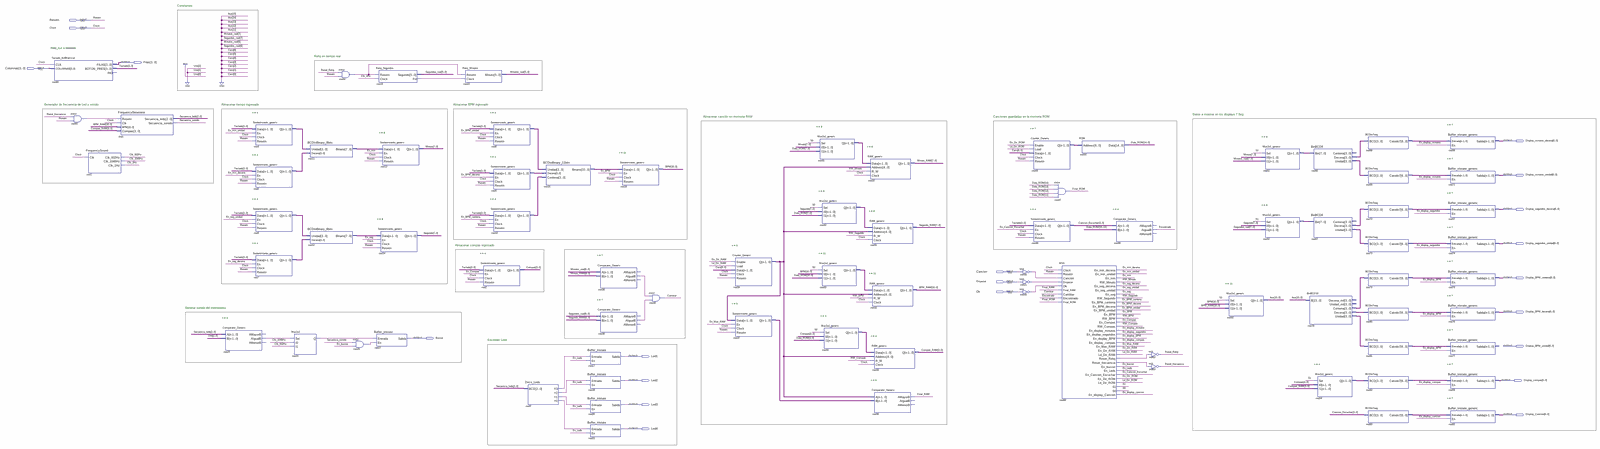
[diagram p0: schematic sheet, whole]
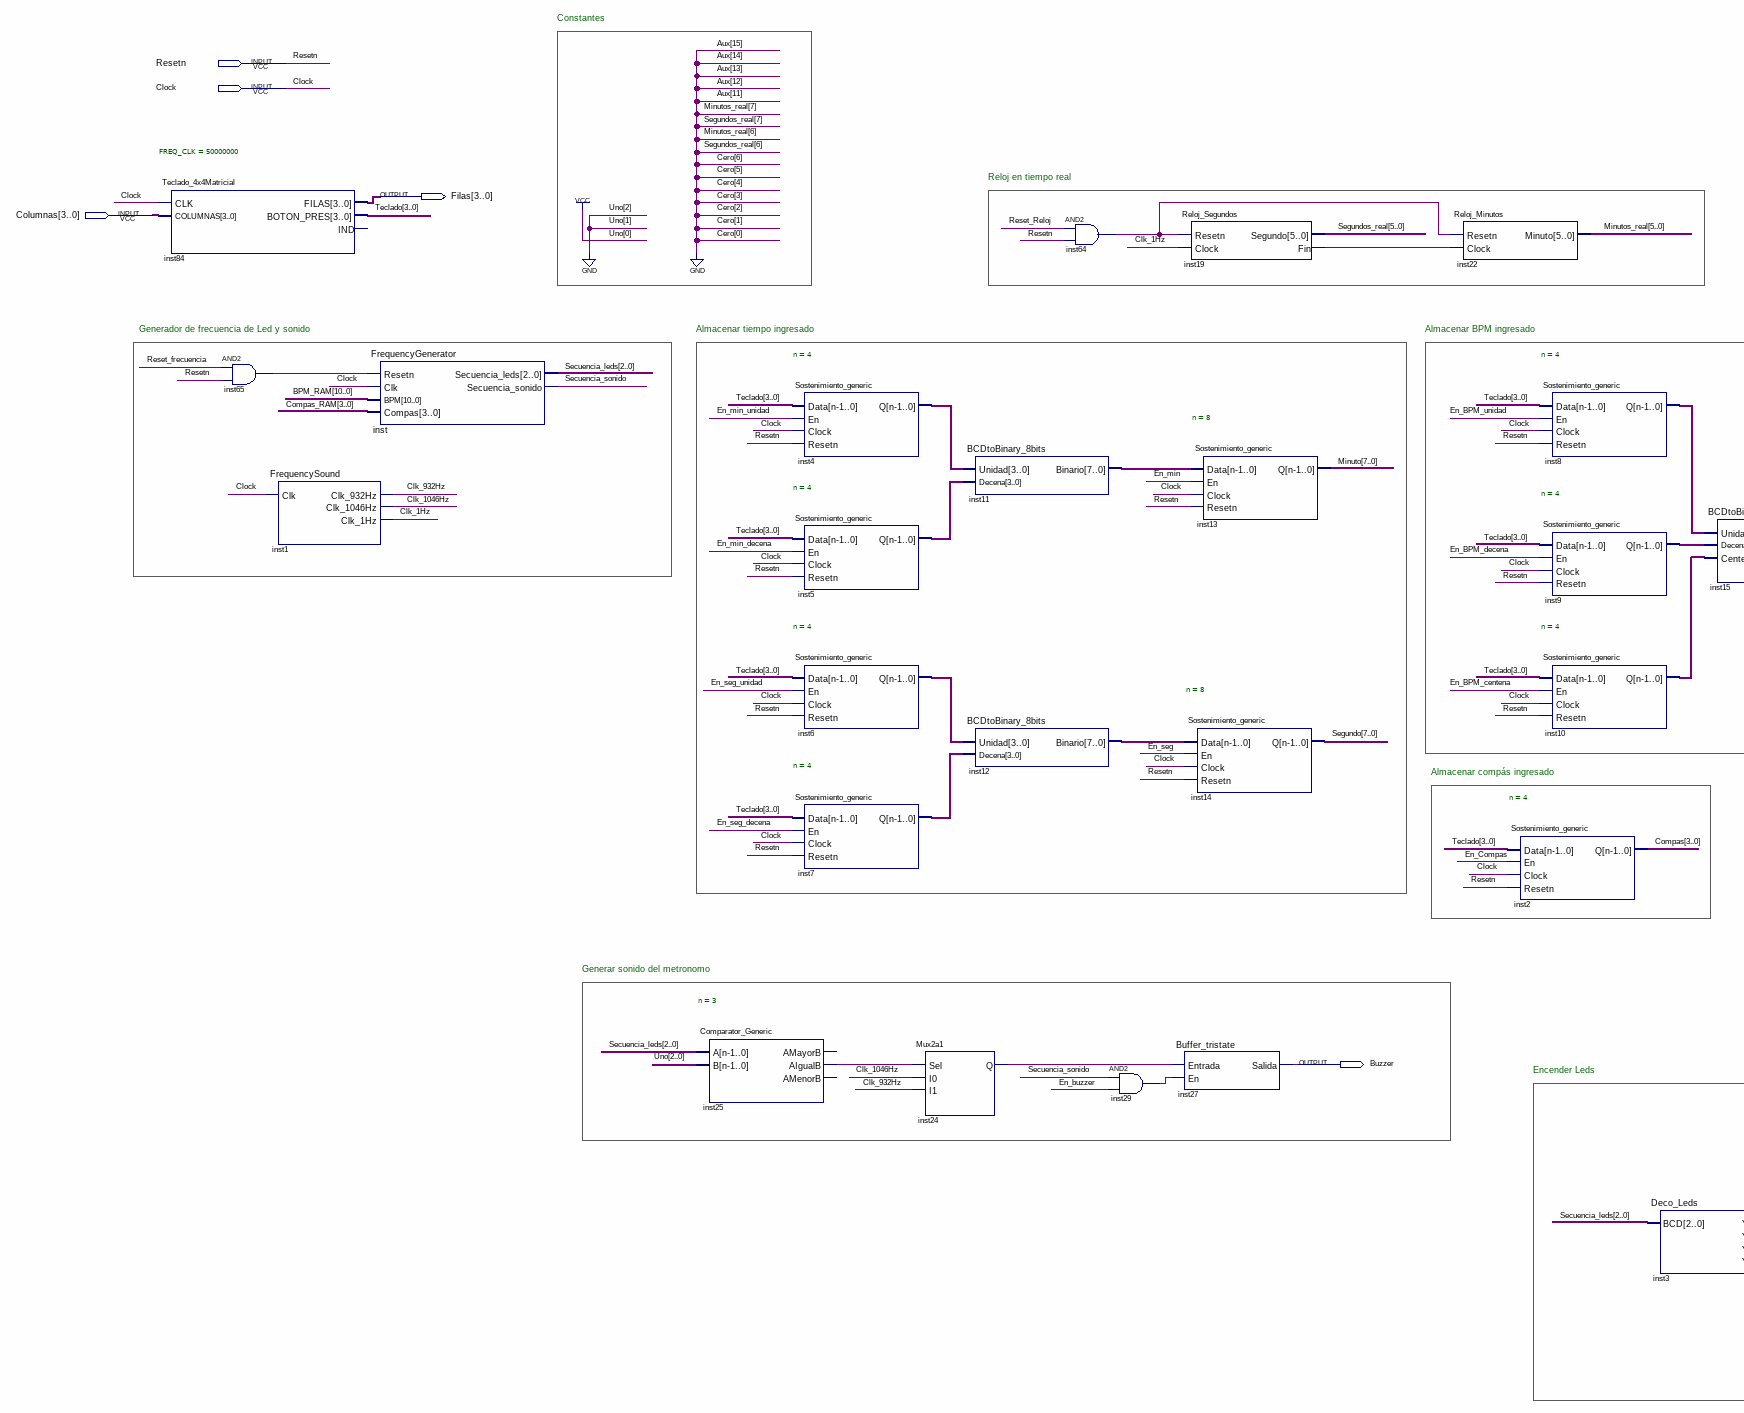
[diagram p1: schematic sheet, left part]
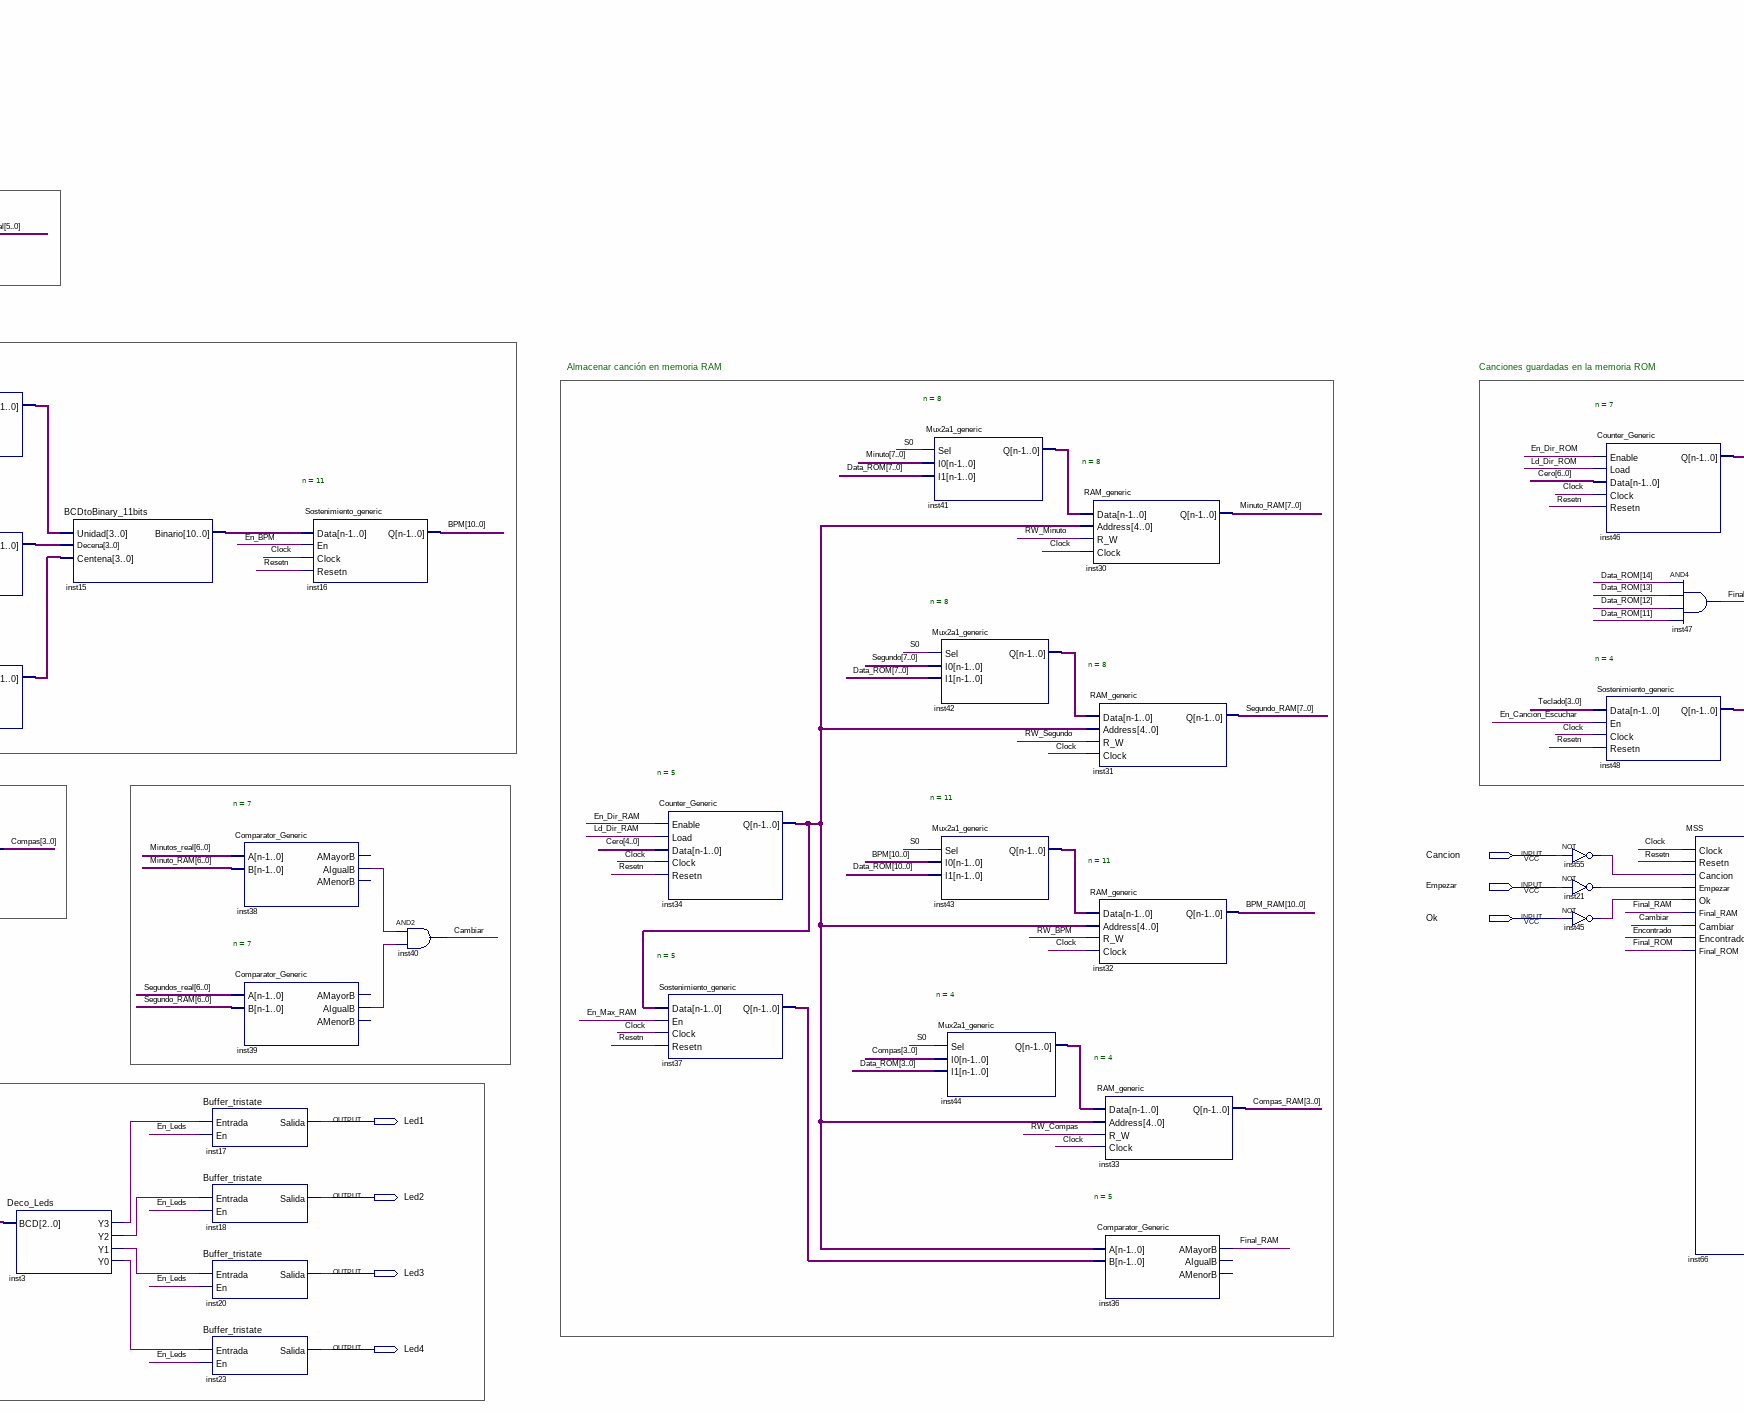
[diagram p2: schematic sheet, centre part]
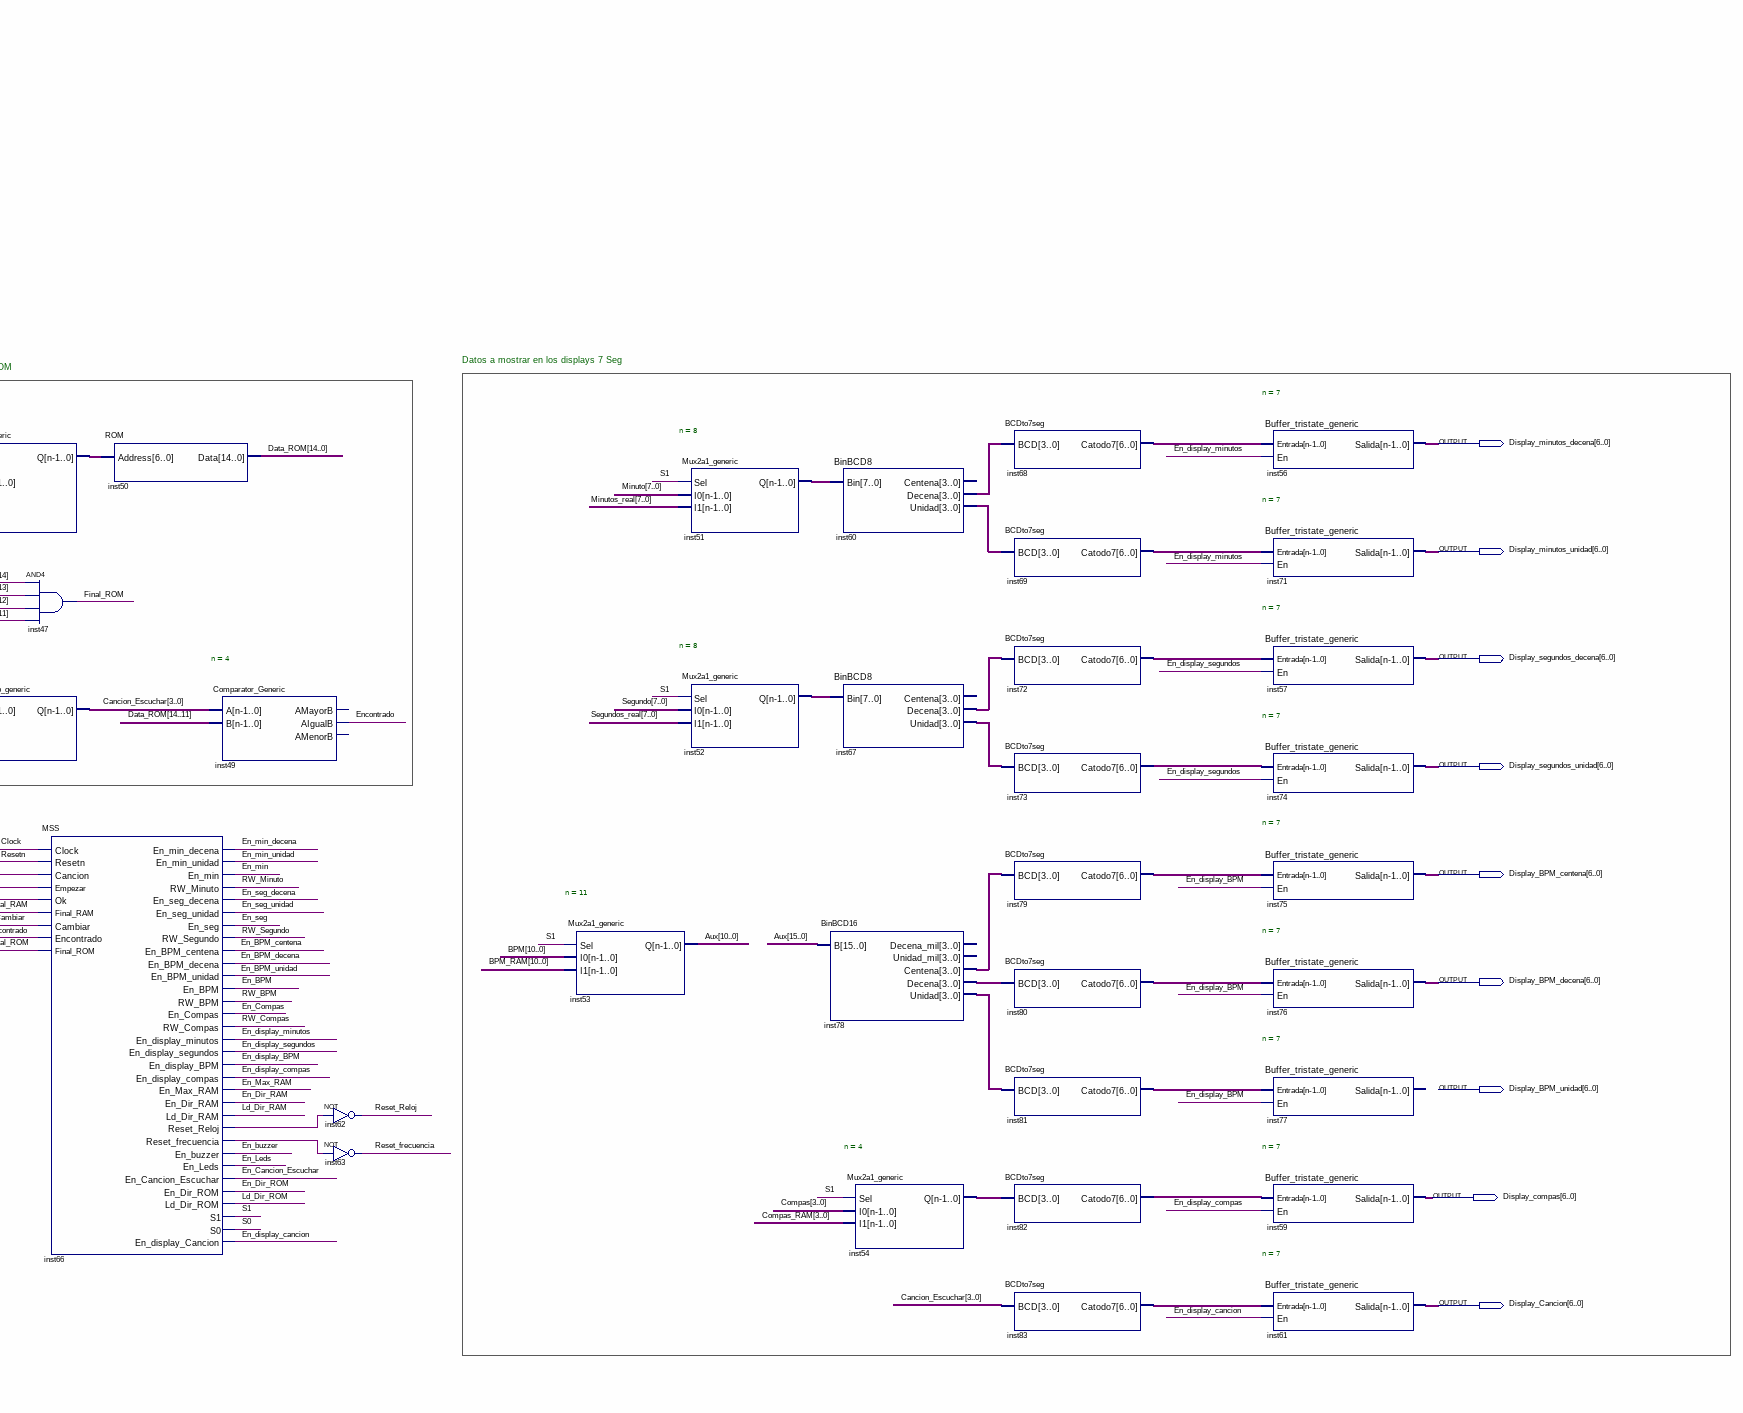
[diagram p3: schematic sheet, right part]
// Quartus schematic Diagram.bdf as structural Verilog: 80 symbols, 21 pins
module Diagram (
  input  Resetn,
  input  Clock,
  input  [3:0] Columnas,
  input  Cancion,
  input  Empezar,
  input  Ok,
  output [3:0] Filas,
  output [6:0] Display_minutos_decena,
  output [6:0] Display_minutos_unidad,
  output [6:0] Display_segundos_decena,
  output [6:0] Display_segundos_unidad,
  output [6:0] Display_BPM_centena,
  output [6:0] Display_BPM_decena,
  output Buzzer,
  output [6:0] Display_BPM_unidad,
  output Led1,
  output Led2,
  output [6:0] Display_compas,
  output Led3,
  output [6:0] Display_Cancion,
  output Led4
);

  wire Cambiar, Clk_1Hz, Clk_932Hz, Clk_1046Hz, En_BPM, En_BPM_centena, En_BPM_decena, En_BPM_unidad,
       En_buzzer, En_Cancion_Escuchar, En_Compas, En_Dir_RAM, En_Dir_ROM, En_display_BPM, En_display_cancion,
       En_display_compas, En_display_minutos, En_display_segundos, En_Leds, En_Max_RAM, En_min,
       En_min_decena, En_min_unidad, En_seg, En_seg_decena, En_seg_unidad, Encontrado, Final_RAM, Final_ROM,
       inst3_y0, inst3_y1, inst3_y2, inst3_y3, inst19_fin, inst21_out, inst24_q, inst25_aigualb, inst29_out,
       inst38_aigualb, inst39_aigualb, inst45_out, inst55_out, inst64_out, inst65_out,
       inst66_reset_frecuencia, inst66_reset_reloj, Ld_Dir_RAM, Ld_Dir_ROM, Reset_frecuencia, Reset_Reloj,
       RW_BPM, RW_Compas, RW_Minuto, RW_Segundo, S0, S1, Secuencia_sonido;
  wire [2:0] Secuencia_leds;
  wire [3:0] Cancion_Escuchar, Compas, Compas_RAM, inst4_q, inst5_q, inst6_q, inst7_q, inst8_q, inst9_q,
       inst10_q, inst44_q, inst54_q, inst60_decena, inst60_unidad, inst67_decena, inst67_unidad,
       inst78_centena, inst78_decena, inst78_unidad, Teclado;
  wire [4:0] inst34_q, inst37_q;
  wire [5:0] Minutos_real, Segundos_real;
  wire [6:0] inst46_q, inst68_catodo7, inst69_catodo7, inst72_catodo7, inst73_catodo7, inst79_catodo7,
       inst80_catodo7, inst81_catodo7, inst82_catodo7, inst83_catodo7;
  wire [7:0] inst11_binario, inst12_binario, inst41_q, inst42_q, inst51_q, inst52_q, Minuto, Minuto_RAM,
       Segundo, Segundo_RAM;
  wire [10:0] Aux, BPM, BPM_RAM, inst15_binario, inst43_q;
  wire [14:0] Data_ROM;

  Teclado_4x4Matricial #(.FREQ_CLK(50000000)) inst84 (
    .CLK(Clock), .COLUMNAS(Columnas), .FILAS(Filas), .BOTON_PRES(Teclado));  // open: IND
  and inst65 (inst65_out, Reset_frecuencia, Resetn);
  FrequencySound inst1 (.Clk(Clock), .Clk_932Hz(Clk_932Hz), .Clk_1046Hz(Clk_1046Hz), .Clk_1Hz(Clk_1Hz));
  FrequencyGenerator inst (
    .Resetn(inst65_out), .Clk(Clock), .BPM(BPM_RAM), .Compas(Compas_RAM), .Secuencia_leds(Secuencia_leds),
    .Secuencia_sonido(Secuencia_sonido));
  Comparator_Generic #(.n(3)) inst25 (
    .A(Secuencia_leds), .B(3'b001), .AIgualB(inst25_aigualb));  // open: AMayorB, AMenorB
  Sostenimiento_generic #(.n(4)) inst4 (
    .Data(Teclado), .En(En_min_unidad), .Clock(Clock), .Resetn(Resetn), .Q(inst4_q));
  Sostenimiento_generic #(.n(4)) inst5 (
    .Data(Teclado), .En(En_min_decena), .Clock(Clock), .Resetn(Resetn), .Q(inst5_q));
  Sostenimiento_generic #(.n(4)) inst6 (
    .Data(Teclado), .En(En_seg_unidad), .Clock(Clock), .Resetn(Resetn), .Q(inst6_q));
  Sostenimiento_generic #(.n(4)) inst7 (
    .Data(Teclado), .En(En_seg_decena), .Clock(Clock), .Resetn(Resetn), .Q(inst7_q));
  Mux2a1 inst24 (.Sel(inst25_aigualb), .I0(Clk_1046Hz), .I1(Clk_932Hz), .Q(inst24_q));
  BCDtoBinary_8bits inst11 (.Unidad(inst4_q), .Decena(inst5_q), .Binario(inst11_binario));
  BCDtoBinary_8bits inst12 (.Unidad(inst6_q), .Decena(inst7_q), .Binario(inst12_binario));
  and inst64 (inst64_out, Reset_Reloj, Resetn);
  and inst29 (inst29_out, Secuencia_sonido, En_buzzer);
  Reloj_Segundos inst19 (.Resetn(inst64_out), .Clock(Clk_1Hz), .Segundo(Segundos_real), .Fin(inst19_fin));
  Sostenimiento_generic #(.n(8)) inst13 (
    .Data(inst11_binario), .En(En_min), .Clock(Clock), .Resetn(Resetn), .Q(Minuto));
  Sostenimiento_generic #(.n(8)) inst14 (
    .Data(inst12_binario), .En(En_seg), .Clock(Clock), .Resetn(Resetn), .Q(Segundo));
  Buffer_tristate inst27 (.Entrada(inst24_q), .En(inst29_out), .Salida(Buzzer));
  Reloj_Minutos inst22 (.Resetn(inst64_out), .Clock(inst19_fin), .Minuto(Minutos_real));
  Sostenimiento_generic #(.n(4)) inst2 (.Data(Teclado), .En(En_Compas), .Clock(Clock), .Resetn(Resetn), .Q(Compas));
  Sostenimiento_generic #(.n(4)) inst8 (
    .Data(Teclado), .En(En_BPM_unidad), .Clock(Clock), .Resetn(Resetn), .Q(inst8_q));
  Sostenimiento_generic #(.n(4)) inst9 (
    .Data(Teclado), .En(En_BPM_decena), .Clock(Clock), .Resetn(Resetn), .Q(inst9_q));
  Sostenimiento_generic #(.n(4)) inst10 (
    .Data(Teclado), .En(En_BPM_centena), .Clock(Clock), .Resetn(Resetn), .Q(inst10_q));
  Deco_Leds inst3 (.BCD(Secuencia_leds), .Y3(inst3_y3), .Y2(inst3_y2), .Y1(inst3_y1), .Y0(inst3_y0));
  BCDtoBinary_11bits inst15 (.Unidad(inst8_q), .Decena(inst9_q), .Centena(inst10_q), .Binario(inst15_binario));
  Buffer_tristate inst17 (.Entrada(inst3_y3), .En(En_Leds), .Salida(Led1));
  Buffer_tristate inst18 (.Entrada(inst3_y2), .En(En_Leds), .Salida(Led2));
  Buffer_tristate inst20 (.Entrada(inst3_y1), .En(En_Leds), .Salida(Led3));
  Buffer_tristate inst23 (.Entrada(inst3_y0), .En(En_Leds), .Salida(Led4));
  Comparator_Generic #(.n(7)) inst38 (
    .A({1'b0, Minutos_real}), .B(Minuto_RAM[6:0]), .AIgualB(inst38_aigualb));  // open: AMayorB, AMenorB
  Comparator_Generic #(.n(7)) inst39 (
    .A({1'b0, Segundos_real}), .B(Segundo_RAM[6:0]), .AIgualB(inst39_aigualb));  // open: AMayorB, AMenorB
  Sostenimiento_generic #(.n(11)) inst16 (.Data(inst15_binario), .En(En_BPM), .Clock(Clock), .Resetn(Resetn), .Q(BPM));
  and inst40 (Cambiar, inst38_aigualb, inst39_aigualb);
  Counter_Generic #(.n(5)) inst34 (
    .Enable(En_Dir_RAM), .Load(Ld_Dir_RAM), .Data({5{1'b0}}), .Clock(Clock), .Resetn(Resetn), .Q(inst34_q));
  Sostenimiento_generic #(.n(5)) inst37 (
    .Data(inst34_q), .En(En_Max_RAM), .Clock(Clock), .Resetn(Resetn), .Q(inst37_q));
  Mux2a1_generic #(.n(8)) inst41 (.Sel(S0), .I0(Minuto), .I1(Data_ROM[7:0]), .Q(inst41_q));
  Mux2a1_generic #(.n(8)) inst42 (.Sel(S0), .I0(Segundo), .I1(Data_ROM[7:0]), .Q(inst42_q));
  Mux2a1_generic #(.n(11)) inst43 (.Sel(S0), .I0(BPM), .I1(Data_ROM[10:0]), .Q(inst43_q));
  Mux2a1_generic #(.n(4)) inst44 (.Sel(S0), .I0(Compas), .I1(Data_ROM[3:0]), .Q(inst44_q));
  RAM_generic #(.n(8)) inst30 (.Data(inst41_q), .Address(inst34_q), .R_W(RW_Minuto), .Clock(Clock), .Q(Minuto_RAM));
  RAM_generic #(.n(8)) inst31 (.Data(inst42_q), .Address(inst34_q), .R_W(RW_Segundo), .Clock(Clock), .Q(Segundo_RAM));
  RAM_generic #(.n(11)) inst32 (.Data(inst43_q), .Address(inst34_q), .R_W(RW_BPM), .Clock(Clock), .Q(BPM_RAM));
  RAM_generic #(.n(4)) inst33 (.Data(inst44_q), .Address(inst34_q), .R_W(RW_Compas), .Clock(Clock), .Q(Compas_RAM));
  Comparator_Generic #(.n(5)) inst36 (.A(inst34_q), .B(inst37_q), .AMayorB(Final_RAM));  // open: AIgualB, AMenorB
  Counter_Generic #(.n(7)) inst46 (
    .Enable(En_Dir_ROM), .Load(Ld_Dir_ROM), .Data({7{1'b0}}), .Clock(Clock), .Resetn(Resetn), .Q(inst46_q));
  Sostenimiento_generic #(.n(4)) inst48 (
    .Data(Teclado), .En(En_Cancion_Escuchar), .Clock(Clock), .Resetn(Resetn), .Q(Cancion_Escuchar));
  not inst55 (inst55_out, Cancion);
  not inst21 (inst21_out, Empezar);
  not inst45 (inst45_out, Ok);
  and inst47 (Final_ROM, Data_ROM[14], Data_ROM[13], Data_ROM[12], Data_ROM[11]);
  MSS inst66 (
    .Clock(Clock), .Resetn(Resetn), .Cancion(inst55_out), .Empezar(inst21_out), .Ok(inst45_out),
    .Final_RAM(Final_RAM), .Cambiar(Cambiar), .Encontrado(Encontrado), .Final_ROM(Final_ROM),
    .En_min_decena(En_min_decena), .En_min_unidad(En_min_unidad), .En_min(En_min), .RW_Minuto(RW_Minuto),
    .En_seg_decena(En_seg_decena), .En_seg_unidad(En_seg_unidad), .En_seg(En_seg), .RW_Segundo(RW_Segundo),
    .En_BPM_centena(En_BPM_centena), .En_BPM_decena(En_BPM_decena), .En_BPM_unidad(En_BPM_unidad),
    .En_BPM(En_BPM), .RW_BPM(RW_BPM), .En_Compas(En_Compas), .RW_Compas(RW_Compas),
    .En_display_minutos(En_display_minutos), .En_display_segundos(En_display_segundos),
    .En_display_BPM(En_display_BPM), .En_display_compas(En_display_compas), .En_Max_RAM(En_Max_RAM),
    .En_Dir_RAM(En_Dir_RAM), .Ld_Dir_RAM(Ld_Dir_RAM), .Reset_Reloj(inst66_reset_reloj),
    .Reset_frecuencia(inst66_reset_frecuencia), .En_buzzer(En_buzzer), .En_Leds(En_Leds),
    .En_Cancion_Escuchar(En_Cancion_Escuchar), .En_Dir_ROM(En_Dir_ROM), .Ld_Dir_ROM(Ld_Dir_ROM), .S1(S1),
    .S0(S0), .En_display_Cancion(En_display_cancion));
  ROM inst50 (.Address(inst46_q), .Data(Data_ROM));
  Comparator_Generic #(.n(4)) inst49 (
    .A(Cancion_Escuchar), .B(Data_ROM[14:11]), .AIgualB(Encontrado));  // open: AMayorB, AMenorB
  not inst62 (Reset_Reloj, inst66_reset_reloj);
  not inst63 (Reset_frecuencia, inst66_reset_frecuencia);
  Mux2a1_generic #(.n(11)) inst53 (.Sel(S1), .I0(BPM), .I1(BPM_RAM), .Q(Aux));
  Mux2a1_generic #(.n(8)) inst51 (.Sel(S1), .I0(Minuto), .I1({2'b00, Minutos_real}), .Q(inst51_q));
  Mux2a1_generic #(.n(8)) inst52 (.Sel(S1), .I0(Segundo), .I1({2'b00, Segundos_real}), .Q(inst52_q));
  BinBCD8 inst60 (.Bin(inst51_q), .Decena(inst60_decena), .Unidad(inst60_unidad));  // open: Centena
  BinBCD8 inst67 (.Bin(inst52_q), .Decena(inst67_decena), .Unidad(inst67_unidad));  // open: Centena
  BinBCD16 inst78 (
    .B({{5{1'b0}}, Aux}), .Centena(inst78_centena), .Decena(inst78_decena), .Unidad(inst78_unidad));  // open: Decena_mil, Unidad_mil
  Mux2a1_generic #(.n(4)) inst54 (.Sel(S1), .I0(Compas), .I1(Compas_RAM), .Q(inst54_q));
  BCDto7seg inst68 (.BCD(inst60_decena), .Catodo7(inst68_catodo7));
  BCDto7seg inst69 (.BCD(inst60_unidad), .Catodo7(inst69_catodo7));
  BCDto7seg inst72 (.BCD(inst67_decena), .Catodo7(inst72_catodo7));
  BCDto7seg inst73 (.BCD(inst67_unidad), .Catodo7(inst73_catodo7));
  BCDto7seg inst79 (.BCD(inst78_centena), .Catodo7(inst79_catodo7));
  BCDto7seg inst80 (.BCD(inst78_decena), .Catodo7(inst80_catodo7));
  BCDto7seg inst81 (.BCD(inst78_unidad), .Catodo7(inst81_catodo7));
  BCDto7seg inst82 (.BCD(inst54_q), .Catodo7(inst82_catodo7));
  BCDto7seg inst83 (.BCD(Cancion_Escuchar), .Catodo7(inst83_catodo7));
  Buffer_tristate_generic #(.n(7)) inst56 (
    .Entrada(inst68_catodo7), .En(En_display_minutos), .Salida(Display_minutos_decena));
  Buffer_tristate_generic #(.n(7)) inst71 (
    .Entrada(inst69_catodo7), .En(En_display_minutos), .Salida(Display_minutos_unidad));
  Buffer_tristate_generic #(.n(7)) inst57 (
    .Entrada(inst72_catodo7), .En(En_display_segundos), .Salida(Display_segundos_decena));
  Buffer_tristate_generic #(.n(7)) inst74 (
    .Entrada(inst73_catodo7), .En(En_display_segundos), .Salida(Display_segundos_unidad));
  Buffer_tristate_generic #(.n(7)) inst75 (.Entrada(inst79_catodo7), .En(En_display_BPM), .Salida(Display_BPM_centena));
  Buffer_tristate_generic #(.n(7)) inst76 (.Entrada(inst80_catodo7), .En(En_display_BPM), .Salida(Display_BPM_decena));
  Buffer_tristate_generic #(.n(7)) inst77 (.Entrada(inst81_catodo7), .En(En_display_BPM));  // open: Salida
  Buffer_tristate_generic #(.n(7)) inst59 (.Entrada(inst82_catodo7), .En(En_display_compas), .Salida(Display_compas));
  Buffer_tristate_generic #(.n(7)) inst61 (.Entrada(inst83_catodo7), .En(En_display_cancion), .Salida(Display_Cancion));

  // Notes on the sheet:
  //   Constantes
  //   Reloj en tiempo real
  //   Generador de frecuencia de Led y sonido
  //   Almacenar tiempo ingresado
  //   Almacenar BPM ingresado
  //   Datos a mostrar en los displays 7 Seg
  //   Almacenar canción en memoria RAM
  //   Canciones guardadas en la memoria ROM
  //   Almacenar compás ingresado
  //   Generar sonido del metronomo
  //   Encender Leds
endmodule
